# EAGLE board xen_teensy_motherboard_8cv_mki (EAGLE 9.6.0), part 1 of 2
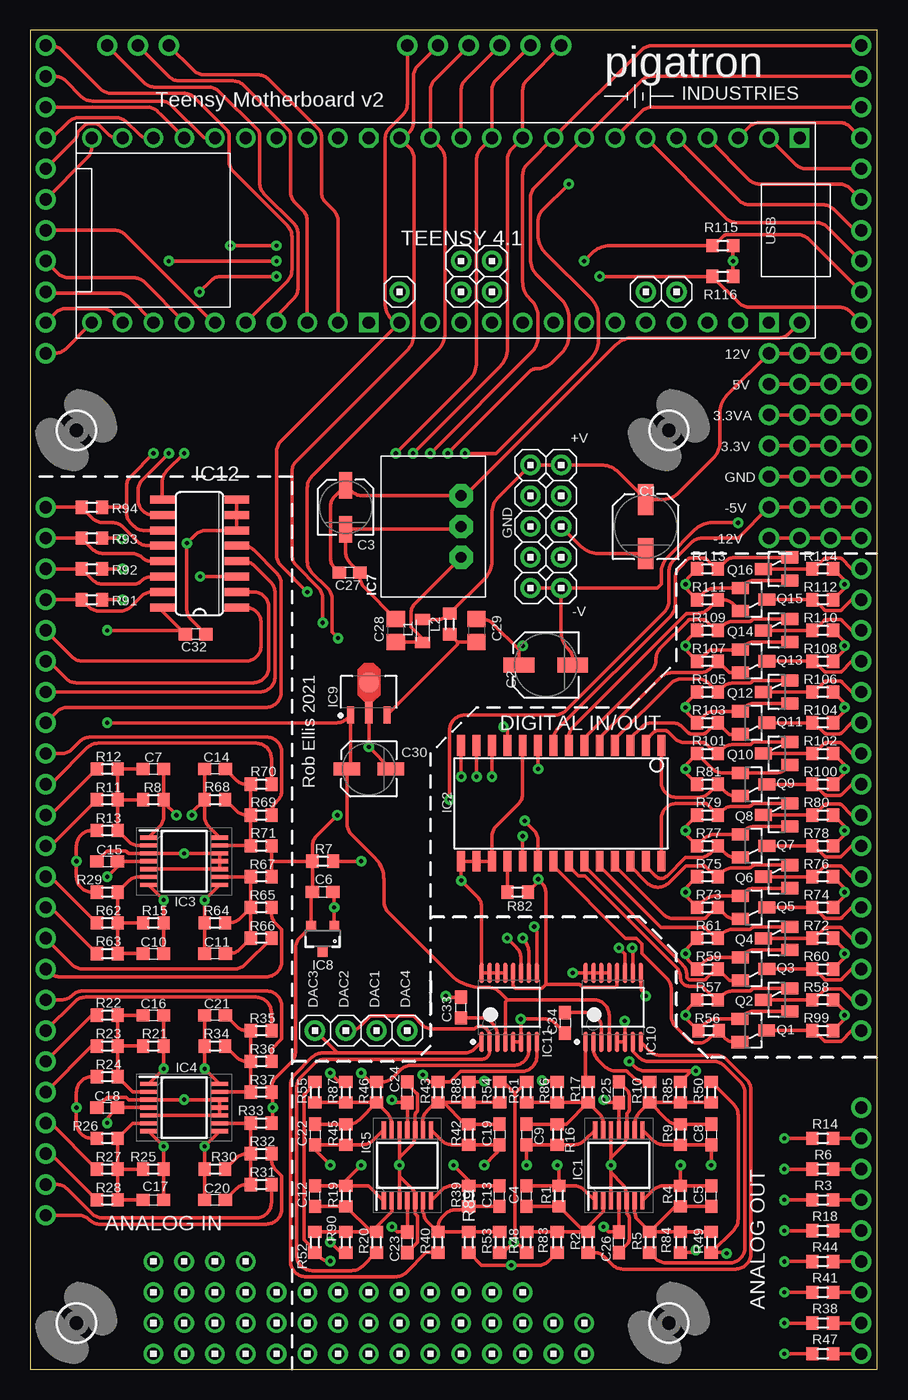
[diagram p1: board, top side]
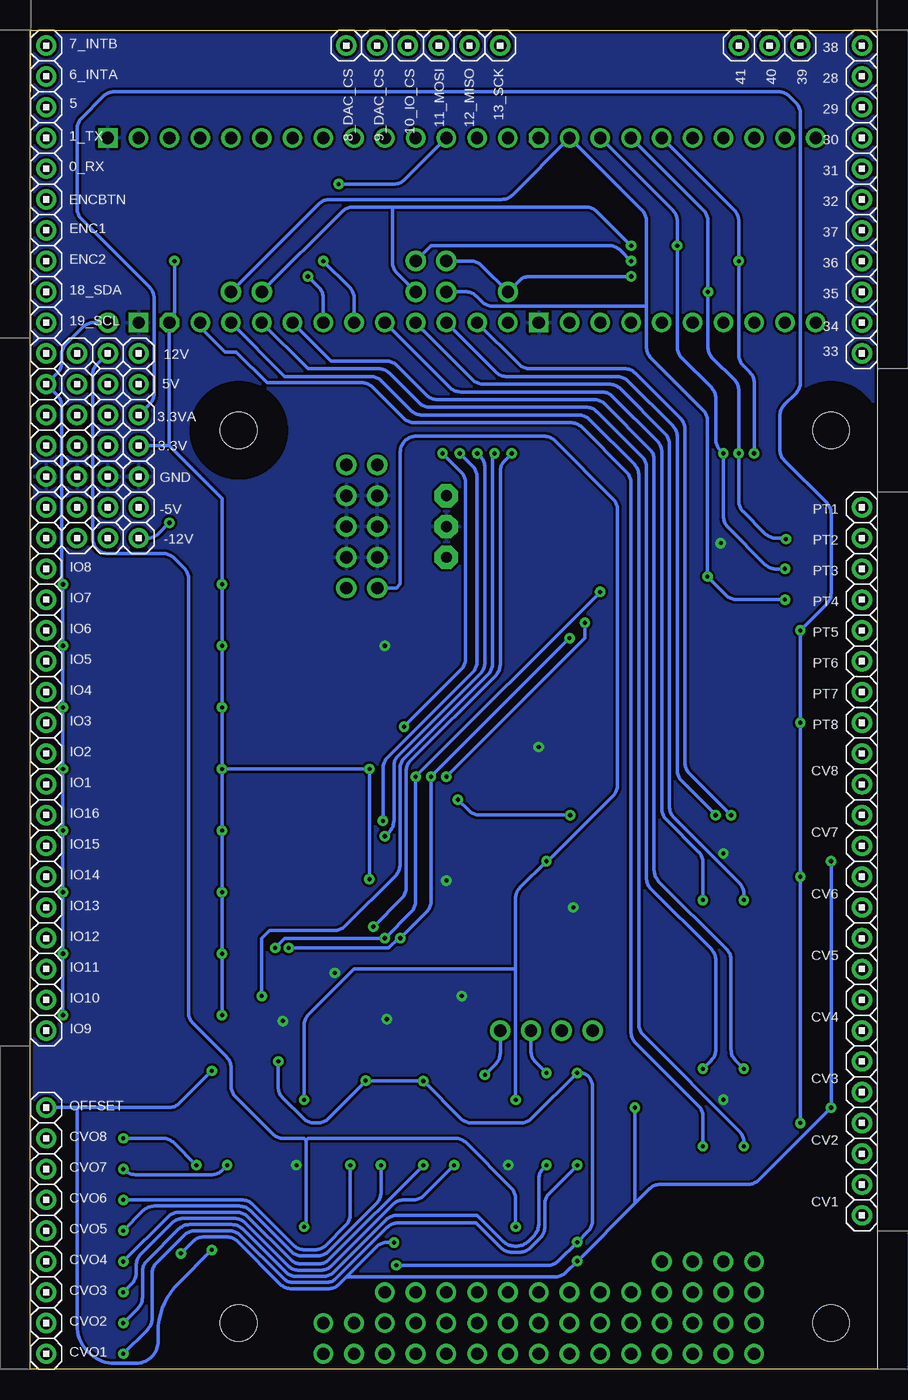
[diagram p2: board, bottom side, seen from below]

Size 69.9 x 110.48 mm. Coordinates in mm from the lower left corner, seen from the top.
Outline: 0,0 69.9,0 69.9,110.48 0,110.48 0,0
Copper layers (1*16): Top 0.0356mm / dielectric 1.5011mm / Bottom 0.0356mm
Design rules "pigatron *": minimum track width 8mil, minimum drill 13mil, track to track 8mil, track to pad 8mil, pad to pad 8mil, via to via 8mil, smd to smd 6mil, copper to edge 10mil, drill to drill 10mil, minimum pad ring 12mil, minimum via ring 10mil, stop-mask expansion 4mil, vias tented up to drill 15mil, thermal gap 10mil

## Footprints (pad centres in the part's own frame; a part is rotated, then mirrored left to right if it is on the bottom)
HEADER/MALE/01 = drill 1.016 pad 1.676: 1 0,0
SV-C = smd 2.54 x 1.27: + -2.223,0; - 2.223,0
SV-B = smd 2.184 x 1.067: + -1.81,0; - 1.81,0
C0603 = smd 1.1 x 1: 1 -0.85,0; 2 0.85,0
C0805 = smd 1.3 x 1.5: 1 -0.95,0; 2 0.95,0
TSSOP14 = smd 0.35 x 1.4: 1 -1.95,-2.938; 2 -1.3,-2.938; 3 -0.65,-2.938; 4 0,-2.938; 5 0.65,-2.938; 6 1.3,-2.938; 7 1.95,-2.938; 8 1.95,2.938; 9 1.3,2.938; 10 0.65,2.938; 11 0,2.938; 12 -0.65,2.938; 13 -1.3,2.938; 14 -1.95,2.938
SO28W = smd 0.65 x 1.7: 1 -7.62,-4.78; 2 -6.35,-4.78; 3 -5.08,-4.78; 4 -3.81,-4.78; 5 -2.54,-4.78; 6 -1.27,-4.78; 7 0,-4.78; 8 1.27,-4.78; 9 2.54,-4.78; 10 3.81,-4.78; 11 5.08,-4.78; 12 6.35,-4.78; 13 7.62,-4.78; 14 8.89,-4.78; 15 8.89,4.78; 16 7.62,4.78; 17 6.35,4.78; 18 5.08,4.78; 19 3.81,4.78; 20 2.54,4.78; 21 1.27,4.78; 22 0,4.78; 23 -1.27,4.78; 24 -2.54,4.78; 25 -3.81,4.78; 26 -5.08,4.78; 27 -6.35,4.78; 28 -7.62,4.78
TENNSY41-OUTER = drill 1: 0-RX1/CS1/CRX2 -27.94,-7.62; 1-TX1/MISO1/CTX2 -25.4,-7.62; 2-OUT2 -22.86,-7.62; 3-LRCLK2 -20.32,-7.62; 4-BCLK2 -17.78,-7.62; 5-IN2 -15.24,-7.62; 6-OUT1D -12.7,-7.62; 7-RX2/OUT1A -10.16,-7.62; 8-TX2/IN1 -7.62,-7.62; 9-OUT1C -5.08,-7.62; 10-CS\MQSR -2.54,-7.62; 11-MOSI/CTX1 0,-7.62; 12-MISO/MQSL 2.54,-7.62; 13-SCK/LED 2.54,7.62; 14-A0/TX3/SPDIF_OUT 0,7.62; 15-A1/RX3/SPDIF_IN -2.54,7.62; 16-A2/RX4/SCL1 -5.08,7.62; 17-A3/TX4/SDA1 -7.62,7.62; 18-A4/SDA0 -10.16,7.62; 19-A5/SCL0 -12.7,7.62; 20-A6/TX5/LRCLK1 -15.24,7.62; 21-A7/RX5/BCLK1 -17.78,7.62; 22-A8/CTX1 -20.32,7.62; 23-A9/CRX1/MCLK1 -22.86,7.62; 24-A10/TX6/SCL2 7.62,-7.62; 25-A11/RX6/SDA2 10.16,-7.62; 26-A12/MOSI1 12.7,-7.62; 27-A13/SCK1 15.24,-7.62; 28-RX7 17.78,-7.62; 29-TX7 20.32,-7.62; 30-CRX3 22.86,-7.62; 31-CTX3 25.4,-7.62; 32-OUT1B 27.94,-7.62; 33-MCLK2 27.94,7.62; 34-RX8 25.4,7.62; 35-TX8 22.86,7.62; 36-PWM 20.32,7.62; 37-PWM 17.78,7.62; 38-A14/CS/IN1 15.24,7.62; 39-A15/CS/OUT1A 12.7,7.62; 40-A16/CS1 10.16,7.62; 41-A17/MISO1 7.62,7.62 | drill 1 octagon: 3V3-1 5.08,-7.62; 3V3-3 -25.4,7.62 | drill 1 square: GND1 -30.48,-7.62; GND3 5.08,7.62; GND6 -27.94,7.62 | drill 1 pad 1.676: VIN -30.48,7.62
WE78 = drill 0.9 pad 1.93 octagon: 1 -2.54,0; 2 0,0; 3 2.54,0
SOT-23 = smd 0.8 x 0.9: 1 -0.95,-1; 2 0.95,-1; 3 0,1.1
LD2981-SOT89 = smd 1.4 x 0.6: 1 -1.9,1.5; 3 -1.9,-1.5 | smd 1.8 x 0.6: 2 -1.7,0 | smd 1.71 x 1.71: 2-2 0.8,0
TEXAS_INSTRUMENTS_DAC8164IBPWG4_1 = smd 1.7 x 0.35: 1 -2.85,2.275; 2 -2.85,1.625; 3 -2.85,0.975; 4 -2.85,0.325; 5 -2.85,-0.325; 6 -2.85,-0.975; 7 -2.85,-1.625; 8 -2.85,-2.275; 9 2.85,-2.275; 10 2.85,-1.625; 11 2.85,-0.975; 12 2.85,-0.325; 13 2.85,0.325; 14 2.85,0.975; 15 2.85,1.625; 16 2.85,2.275
SO16 = smd 0.66 x 2.032: 1 -4.445,-3.073; 2 -3.175,-3.073; 3 -1.905,-3.073; 4 -0.635,-3.073; 5 0.635,-3.073; 6 1.905,-3.073; 7 3.175,-3.073; 8 4.445,-3.073; 9 4.445,3.073; 10 3.175,3.073; 11 1.905,3.073; 12 0.635,3.073; 13 -0.635,3.073; 14 -1.905,3.073; 15 -3.175,3.073; 16 -4.445,3.073
L2012C = smd 0.9 x 1.25: 1 -0.9,0; 2 1,0
R0603 = smd 1 x 1.1: 1 -0.85,0; 2 0.85,0
HEADER/MALE/01/NOBORDER = drill 1.016: 1 0,0
SOT23 = smd 1 x 1.4: 1 -0.95,-1.1; 2 0.95,-1.1; 3 0,1.1
STANDOFF/3.0 = hole 3: 0,0

## Placement (x,y rotation side)
0_RX  HEADER/MALE/01  [HEADER/MALE/01]  68.58,99.06 0 bottom
1_TX  HEADER/MALE/01  [HEADER/MALE/01]  68.58,101.6 0 bottom
3.3V  HEADER/MALE/01  [HEADER/MALE/01]  60.96,76.2 90 bottom
3.3V1  HEADER/MALE/01  [HEADER/MALE/01]  63.5,76.2 180 bottom
3.3V2  HEADER/MALE/01  [HEADER/MALE/01]  66.04,76.2 0 bottom
3.3V3  HEADER/MALE/01  [HEADER/MALE/01]  68.58,76.2 0 bottom
3.3VA  HEADER/MALE/01  [HEADER/MALE/01]  60.96,78.74 180 bottom
3.3VA1  HEADER/MALE/01  [HEADER/MALE/01]  63.5,78.74 0 bottom
3.3VA2  HEADER/MALE/01  [HEADER/MALE/01]  66.04,78.74 0 bottom
3.3VA3  HEADER/MALE/01  [HEADER/MALE/01]  68.58,78.74 0 bottom
5  HEADER/MALE/01  [HEADER/MALE/01]  68.58,104.14 0 bottom
5V  HEADER/MALE/01  [HEADER/MALE/01]  60.96,81.28 180 bottom
5V1  HEADER/MALE/01  [HEADER/MALE/01]  63.5,81.28 180 bottom
5V2  HEADER/MALE/01  [HEADER/MALE/01]  66.04,81.28 0 bottom
5V3  HEADER/MALE/01  [HEADER/MALE/01]  68.58,81.28 0 bottom
6_INTA  HEADER/MALE/01  [HEADER/MALE/01]  68.58,106.68 0 bottom
7_INTB  HEADER/MALE/01  [HEADER/MALE/01]  68.58,109.22 0 bottom
8_DAC_CS  HEADER/MALE/01  [HEADER/MALE/01]  43.81,109.22 270 bottom
9_DAC_CS  HEADER/MALE/01  [HEADER/MALE/01]  41.27,109.22 270 bottom
10_IO_CS  HEADER/MALE/01  [HEADER/MALE/01]  38.73,109.22 270 bottom
11_MOSI  HEADER/MALE/01  [HEADER/MALE/01]  36.2,109.22 270 bottom
12_MISO  HEADER/MALE/01  [HEADER/MALE/01]  33.66,109.22 270 bottom
13_SCK  HEADER/MALE/01  [HEADER/MALE/01]  31.11,109.22 270 bottom
18_SDA  HEADER/MALE/01  [HEADER/MALE/01]  68.58,88.9 0 bottom
19_SCL  HEADER/MALE/01  [HEADER/MALE/01]  68.58,86.36 0 bottom
24_4.0-A10  HEADER/MALE/01  [HEADER/MALE/01]  35.56,88.9 0 top
24_LC-A10  HEADER/MALE/01  [HEADER/MALE/01]  53.34,88.9 90 top
25_4.0-A11  HEADER/MALE/01  [HEADER/MALE/01]  38.1,88.9 0 top
25_LC-A11  HEADER/MALE/01  [HEADER/MALE/01]  50.8,88.9 90 top
26_4.0-A12  HEADER/MALE/01  [HEADER/MALE/01]  35.56,91.44 0 top
26_LC-A12  HEADER/MALE/01  [HEADER/MALE/01]  30.48,88.9 90 top
27_4.0-A13  HEADER/MALE/01  [HEADER/MALE/01]  38.1,91.44 0 top
28  HEADER/MALE/01  [HEADER/MALE/01]  1.27,106.68 180 bottom
29  HEADER/MALE/01  [HEADER/MALE/01]  1.27,104.14 180 bottom
30  HEADER/MALE/01  [HEADER/MALE/01]  1.27,101.6 180 bottom
31  HEADER/MALE/01  [HEADER/MALE/01]  1.27,99.06 180 bottom
32  HEADER/MALE/01  [HEADER/MALE/01]  1.27,96.52 180 bottom
33  HEADER/MALE/01  [HEADER/MALE/01]  1.27,83.82 180 bottom
34  HEADER/MALE/01  [HEADER/MALE/01]  1.27,86.36 180 bottom
35  HEADER/MALE/01  [HEADER/MALE/01]  1.27,88.9 180 bottom
36  HEADER/MALE/01  [HEADER/MALE/01]  1.27,91.44 180 bottom
37  HEADER/MALE/01  [HEADER/MALE/01]  1.27,93.98 180 bottom
38  HEADER/MALE/01  [HEADER/MALE/01]  1.27,109.22 180 bottom
39  HEADER/MALE/01  [HEADER/MALE/01]  6.35,109.22 270 bottom
40  HEADER/MALE/01  [HEADER/MALE/01]  8.89,109.22 270 bottom
41  HEADER/MALE/01  [HEADER/MALE/01]  11.43,109.22 270 bottom
+V  HEADER/MALE/01  [HEADER/MALE/01]  43.81,74.61 0 top
+V1  HEADER/MALE/01  [HEADER/MALE/01]  63.5,83.82 0 bottom
+V2  HEADER/MALE/01  [HEADER/MALE/01]  41.27,74.61 180 top
+V3  HEADER/MALE/01  [HEADER/MALE/01]  60.96,83.82 0 bottom
+V4  HEADER/MALE/01  [HEADER/MALE/01]  66.04,83.82 0 bottom
+V5  HEADER/MALE/01  [HEADER/MALE/01]  68.58,83.82 0 bottom
-5V  HEADER/MALE/01  [HEADER/MALE/01]  63.5,71.12 180 bottom
-5V1  HEADER/MALE/01  [HEADER/MALE/01]  60.96,71.12 180 bottom
-5V2  HEADER/MALE/01  [HEADER/MALE/01]  66.04,71.12 0 bottom
-5V3  HEADER/MALE/01  [HEADER/MALE/01]  68.58,71.12 0 bottom
-V  HEADER/MALE/01  [HEADER/MALE/01]  43.81,64.45 0 top
-V1  HEADER/MALE/01  [HEADER/MALE/01]  60.96,68.58 0 bottom
-V2  HEADER/MALE/01  [HEADER/MALE/01]  41.27,64.45 180 top
-V3  HEADER/MALE/01  [HEADER/MALE/01]  63.5,68.58 0 bottom
-V4  HEADER/MALE/01  [HEADER/MALE/01]  66.04,68.58 0 bottom
-V5  HEADER/MALE/01  [HEADER/MALE/01]  68.58,68.58 0 bottom
C1  22uF  [SV-C]  50.8,69.53 270 top
C2  22uF  [SV-C]  42.55,58.1 0 top
C3  10uF  [SV-B]  26.04,71.12 270 top
C4  100pF  [C0603]  40.96,14.29 90 top
C5  100pF  [C0603]  56.2,14.29 90 top
C6  100nF  [C0603]  24.13,39.37 180 top
C7  1nF  [C0603]  10.16,49.53 0 top
C8  100pF  [C0603]  56.2,19.37 270 top
C9  100pF  [C0603]  40.96,19.37 270 top
C10  1nF  [C0603]  10.16,34.29 0 top
C11  1nF  [C0603]  15.24,34.29 180 top
C12  100pF  [C0603]  23.5,14.29 90 top
C13  100pF  [C0603]  38.73,14.29 90 top
C14  1nF  [C0603]  15.24,49.53 180 top
C15  100nF  [C0603]  6.35,41.91 0 top
C16  1nF  [C0603]  10.16,29.21 0 top
C17  1nF  [C0603]  10.16,13.97 0 top
C18  100nF  [C0603]  6.35,21.59 0 top
C19  100pF  [C0603]  38.73,19.37 270 top
C20  1nF  [C0603]  15.24,13.97 180 top
C21  1nF  [C0603]  15.24,29.21 180 top
C22  100pF  [C0603]  23.5,19.37 270 top
C23  100nF  [C0603]  31.11,10.48 90 top
C24  100nF  [C0603]  31.11,22.86 90 top
C25  100nF  [C0603]  48.58,22.86 90 top
C26  100nF  [C0603]  48.58,10.48 90 top
C27  100nF  [C0603]  26.35,65.72 180 top
C28  22uF  [C0805]  30.16,60.96 270 top
C29  22uF  [C0805]  36.83,60.96 270 top
C30  10uF  [SV-B]  27.94,49.53 0 top
C32  100nF  [C0603]  13.65,60.64 180 top
C33  470nF  [C0603]  35.56,29.84 90 top
C34  470nF  [C0603]  44.13,28.57 270 top
CV1  HEADER/MALE/01  [HEADER/MALE/01]  1.27,15.24 0 bottom
CV1B  HEADER/MALE/01  [HEADER/MALE/01]  1.27,12.7 0 bottom
CV2  HEADER/MALE/01  [HEADER/MALE/01]  1.27,20.32 0 bottom
CV2B  HEADER/MALE/01  [HEADER/MALE/01]  1.27,17.78 0 bottom
CV3  HEADER/MALE/01  [HEADER/MALE/01]  1.27,25.4 0 bottom
CV3B  HEADER/MALE/01  [HEADER/MALE/01]  1.27,22.86 0 bottom
CV4  HEADER/MALE/01  [HEADER/MALE/01]  1.27,27.94 0 bottom
CV4B  HEADER/MALE/01  [HEADER/MALE/01]  1.27,30.48 0 bottom
CV5  HEADER/MALE/01  [HEADER/MALE/01]  1.27,33.02 180 bottom
CV5B  HEADER/MALE/01  [HEADER/MALE/01]  1.27,35.56 180 bottom
CV6  HEADER/MALE/01  [HEADER/MALE/01]  1.27,40.64 180 bottom
CV6B  HEADER/MALE/01  [HEADER/MALE/01]  1.27,38.1 180 bottom
CV7  HEADER/MALE/01  [HEADER/MALE/01]  1.27,43.18 180 bottom
CV7B  HEADER/MALE/01  [HEADER/MALE/01]  1.27,45.72 180 bottom
CV8  HEADER/MALE/01  [HEADER/MALE/01]  1.27,50.8 180 bottom
CV8B  HEADER/MALE/01  [HEADER/MALE/01]  1.27,48.26 180 bottom
CVO1  HEADER/MALE/01  [HEADER/MALE/01]  68.58,1.27 0 bottom
CVO2  HEADER/MALE/01  [HEADER/MALE/01]  68.58,3.81 0 bottom
CVO3  HEADER/MALE/01  [HEADER/MALE/01]  68.58,6.35 0 bottom
CVO4  HEADER/MALE/01  [HEADER/MALE/01]  68.58,8.89 0 bottom
CVO5  HEADER/MALE/01  [HEADER/MALE/01]  68.58,11.43 0 bottom
CVO6  HEADER/MALE/01  [HEADER/MALE/01]  68.58,13.97 0 bottom
CVO7  HEADER/MALE/01  [HEADER/MALE/01]  68.58,16.51 0 bottom
CVO8  HEADER/MALE/01  [HEADER/MALE/01]  68.58,19.05 0 bottom
DAC1  HEADER/MALE/01  [HEADER/MALE/01]  28.57,27.94 90 top
DAC2  HEADER/MALE/01  [HEADER/MALE/01]  26.04,27.94 90 top
DAC3  HEADER/MALE/01  [HEADER/MALE/01]  23.5,27.94 90 top
DAC4  HEADER/MALE/01  [HEADER/MALE/01]  31.11,27.94 90 top
ENC1  HEADER/MALE/01  [HEADER/MALE/01]  68.58,93.98 0 bottom
ENC2  HEADER/MALE/01  [HEADER/MALE/01]  68.58,91.44 0 bottom
ENCBTN  HEADER/MALE/01  [HEADER/MALE/01]  68.58,96.52 0 bottom
GND  HEADER/MALE/01  [HEADER/MALE/01]  43.81,69.53 0 top
GND1  HEADER/MALE/01  [HEADER/MALE/01]  43.81,72.07 0 top
GND2  HEADER/MALE/01  [HEADER/MALE/01]  41.27,66.99 180 top
GND3  HEADER/MALE/01  [HEADER/MALE/01]  43.81,66.99 180 top
GND4  HEADER/MALE/01  [HEADER/MALE/01]  41.27,69.53 0 top
GND5  HEADER/MALE/01  [HEADER/MALE/01]  41.27,72.07 0 top
GND6  HEADER/MALE/01  [HEADER/MALE/01]  63.5,73.66 0 bottom
GND7  HEADER/MALE/01  [HEADER/MALE/01]  60.96,73.66 0 bottom
GND8  HEADER/MALE/01  [HEADER/MALE/01]  66.04,73.66 0 bottom
GND9  HEADER/MALE/01  [HEADER/MALE/01]  68.58,73.66 0 bottom
IC1  TL074PW  [TSSOP14]  48.58,16.83 0 top
IC2  MCP23S17SO  [SO28W]  44.45,46.69 180 top
IC3  MCP6004  [TSSOP14]  12.7,41.91 270 top
IC4  MCP6004  [TSSOP14]  12.7,21.59 270 top
IC5  TL074PW  [TSSOP14]  31.11,16.83 0 top
IC6  TEENSY41-OUTER  [TENNSY41-OUTER]  33.02,93.98 180 top
IC7  R-78E5.0-0.5  [WE78]  35.56,69.53 90 top
IC8  LM4040-5V  [SOT-23]  24.13,35.56 180 top
IC9  3.3V  [LD2981-SOT89]  27.94,55.88 90 top
IC10  DAC8164  [TEXAS_INSTRUMENTS_DAC8164IBPWG4_1]  48.1,29.84 90 top
IC11  DAC8164  [TEXAS_INSTRUMENTS_DAC8164IBPWG4_1]  39.53,29.84 90 top
IC12  CD4051CD4051_SO16  [SO16]  13.97,67.31 90 top
IO1  HEADER/MALE/01  [HEADER/MALE/01]  68.58,48.26 180 bottom
IO2  HEADER/MALE/01  [HEADER/MALE/01]  68.58,50.8 180 bottom
IO3  HEADER/MALE/01  [HEADER/MALE/01]  68.58,53.34 180 bottom
IO4  HEADER/MALE/01  [HEADER/MALE/01]  68.58,55.88 180 bottom
IO5  HEADER/MALE/01  [HEADER/MALE/01]  68.58,58.42 180 bottom
IO6  HEADER/MALE/01  [HEADER/MALE/01]  68.58,60.96 180 bottom
IO7  HEADER/MALE/01  [HEADER/MALE/01]  68.58,63.5 180 bottom
IO8  HEADER/MALE/01  [HEADER/MALE/01]  68.58,66.04 180 bottom
IO9  HEADER/MALE/01  [HEADER/MALE/01]  68.58,27.94 180 bottom
IO10  HEADER/MALE/01  [HEADER/MALE/01]  68.58,30.48 180 bottom
IO11  HEADER/MALE/01  [HEADER/MALE/01]  68.58,33.02 180 bottom
IO12  HEADER/MALE/01  [HEADER/MALE/01]  68.58,35.56 180 bottom
IO13  HEADER/MALE/01  [HEADER/MALE/01]  68.58,38.1 180 bottom
IO14  HEADER/MALE/01  [HEADER/MALE/01]  68.58,40.64 180 bottom
IO15  HEADER/MALE/01  [HEADER/MALE/01]  68.58,43.18 180 bottom
IO16  HEADER/MALE/01  [HEADER/MALE/01]  68.58,45.72 180 bottom
L1  33uH  [L2012C]  32.38,60.96 270 top
L2  [R0603]  34.61,61.49 270 top
OFFSET  HEADER/MALE/01  [HEADER/MALE/01]  68.58,21.59 180 bottom
P1  HEADER/MALE/01NOBORDER  [HEADER/MALE/01/NOBORDER]  10.16,1.27 0 top
P2  HEADER/MALE/01NOBORDER  [HEADER/MALE/01/NOBORDER]  12.7,1.27 0 top
P3  HEADER/MALE/01NOBORDER  [HEADER/MALE/01/NOBORDER]  15.24,1.27 0 top
P4  HEADER/MALE/01NOBORDER  [HEADER/MALE/01/NOBORDER]  17.78,1.27 0 top
P5  HEADER/MALE/01NOBORDER  [HEADER/MALE/01/NOBORDER]  20.32,1.27 0 top
P6  HEADER/MALE/01NOBORDER  [HEADER/MALE/01/NOBORDER]  10.16,3.81 0 top
P7  HEADER/MALE/01NOBORDER  [HEADER/MALE/01/NOBORDER]  12.7,3.81 0 top
P8  HEADER/MALE/01NOBORDER  [HEADER/MALE/01/NOBORDER]  15.24,3.81 0 top
P9  HEADER/MALE/01NOBORDER  [HEADER/MALE/01/NOBORDER]  17.78,3.81 0 top
P10  HEADER/MALE/01NOBORDER  [HEADER/MALE/01/NOBORDER]  20.32,3.81 0 top
P11  HEADER/MALE/01NOBORDER  [HEADER/MALE/01/NOBORDER]  10.16,6.35 0 top
P12  HEADER/MALE/01NOBORDER  [HEADER/MALE/01/NOBORDER]  12.7,6.35 0 top
P13  HEADER/MALE/01NOBORDER  [HEADER/MALE/01/NOBORDER]  15.24,6.35 0 top
P14  HEADER/MALE/01NOBORDER  [HEADER/MALE/01/NOBORDER]  17.78,6.35 0 top
P15  HEADER/MALE/01NOBORDER  [HEADER/MALE/01/NOBORDER]  20.32,6.35 0 top
P16  HEADER/MALE/01NOBORDER  [HEADER/MALE/01/NOBORDER]  10.16,8.89 0 top
P17  HEADER/MALE/01NOBORDER  [HEADER/MALE/01/NOBORDER]  12.7,8.89 0 top
P18  HEADER/MALE/01NOBORDER  [HEADER/MALE/01/NOBORDER]  15.24,8.89 0 top
P19  HEADER/MALE/01NOBORDER  [HEADER/MALE/01/NOBORDER]  17.78,8.89 0 top
P21  HEADER/MALE/01NOBORDER  [HEADER/MALE/01/NOBORDER]  22.86,1.27 0 top
P22  HEADER/MALE/01NOBORDER  [HEADER/MALE/01/NOBORDER]  22.86,3.81 0 top
P23  HEADER/MALE/01NOBORDER  [HEADER/MALE/01/NOBORDER]  25.4,1.27 0 top
P24  HEADER/MALE/01NOBORDER  [HEADER/MALE/01/NOBORDER]  22.86,6.35 0 top
P25  HEADER/MALE/01NOBORDER  [HEADER/MALE/01/NOBORDER]  25.4,3.81 0 top
P26  HEADER/MALE/01NOBORDER  [HEADER/MALE/01/NOBORDER]  25.4,6.35 0 top
P27  HEADER/MALE/01NOBORDER  [HEADER/MALE/01/NOBORDER]  30.48,6.35 0 top
P28  HEADER/MALE/01NOBORDER  [HEADER/MALE/01/NOBORDER]  27.94,6.35 0 top
P29  HEADER/MALE/01NOBORDER  [HEADER/MALE/01/NOBORDER]  30.48,3.81 0 top
P30  HEADER/MALE/01NOBORDER  [HEADER/MALE/01/NOBORDER]  27.94,3.81 0 top
P31  HEADER/MALE/01NOBORDER  [HEADER/MALE/01/NOBORDER]  30.48,1.27 0 top
P32  HEADER/MALE/01NOBORDER  [HEADER/MALE/01/NOBORDER]  27.94,1.27 0 top
P33  HEADER/MALE/01NOBORDER  [HEADER/MALE/01/NOBORDER]  33.02,6.35 0 top
P34  HEADER/MALE/01NOBORDER  [HEADER/MALE/01/NOBORDER]  33.02,3.81 0 top
P35  HEADER/MALE/01NOBORDER  [HEADER/MALE/01/NOBORDER]  35.56,6.35 0 top
P36  HEADER/MALE/01NOBORDER  [HEADER/MALE/01/NOBORDER]  33.02,1.27 0 top
P37  HEADER/MALE/01NOBORDER  [HEADER/MALE/01/NOBORDER]  38.1,3.81 0 top
P38  HEADER/MALE/01NOBORDER  [HEADER/MALE/01/NOBORDER]  35.56,3.81 0 top
P39  HEADER/MALE/01NOBORDER  [HEADER/MALE/01/NOBORDER]  40.64,6.35 0 top
P40  HEADER/MALE/01NOBORDER  [HEADER/MALE/01/NOBORDER]  35.56,1.27 0 top
P41  HEADER/MALE/01NOBORDER  [HEADER/MALE/01/NOBORDER]  40.64,3.81 0 top
P42  HEADER/MALE/01NOBORDER  [HEADER/MALE/01/NOBORDER]  38.1,6.35 0 top
P44  HEADER/MALE/01NOBORDER  [HEADER/MALE/01/NOBORDER]  38.1,1.27 0 top
P45  HEADER/MALE/01NOBORDER  [HEADER/MALE/01/NOBORDER]  43.18,3.81 0 top
P46  HEADER/MALE/01NOBORDER  [HEADER/MALE/01/NOBORDER]  40.64,1.27 0 top
P47  HEADER/MALE/01NOBORDER  [HEADER/MALE/01/NOBORDER]  43.18,1.27 0 top
P49  HEADER/MALE/01NOBORDER  [HEADER/MALE/01/NOBORDER]  45.72,3.81 0 top
P50  HEADER/MALE/01NOBORDER  [HEADER/MALE/01/NOBORDER]  45.72,1.27 0 top
PT1  HEADER/MALE/01  [HEADER/MALE/01]  1.27,71.12 180 bottom
PT2  HEADER/MALE/01  [HEADER/MALE/01]  1.27,68.58 180 bottom
PT3  HEADER/MALE/01  [HEADER/MALE/01]  1.27,66.04 180 bottom
PT4  HEADER/MALE/01  [HEADER/MALE/01]  1.27,63.5 180 bottom
PT5  HEADER/MALE/01  [HEADER/MALE/01]  1.27,60.96 180 bottom
PT6  HEADER/MALE/01  [HEADER/MALE/01]  1.27,58.42 180 bottom
PT7  HEADER/MALE/01  [HEADER/MALE/01]  1.27,55.88 180 bottom
PT8  HEADER/MALE/01  [HEADER/MALE/01]  1.27,53.34 180 bottom
Q1  BF170  [SOT23]  59.67,27.94 270 top
Q2  BF170  [SOT23]  61.59,30.48 90 top
Q3  BF170  [SOT23]  59.69,33.02 270 top
Q4  BF170  [SOT23]  61.59,35.56 90 top
Q5  BF170  [SOT23]  59.69,38.1 270 top
Q6  BF170  [SOT23]  61.59,40.64 90 top
Q7  BF170  [SOT23]  59.69,43.18 270 top
Q8  BF170  [SOT23]  61.59,45.72 90 top
Q9  BF170  [SOT23]  59.69,48.26 270 top
Q10  BF170  [SOT23]  61.59,50.8 90 top
Q11  BF170  [SOT23]  59.69,53.34 270 top
Q12  BF170  [SOT23]  61.59,55.88 90 top
Q13  BF170  [SOT23]  59.69,58.42 270 top
Q14  BF170  [SOT23]  61.59,60.96 90 top
Q15  BF170  [SOT23]  59.69,63.5 270 top
Q16  BF170  [SOT23]  61.59,66.04 90 top
R1  120k  [R0603]  43.62,14.29 90 top
R2  30k  [R0603]  46.04,10.48 90 top
R3  1k  [R0603]  65.41,13.97 0 top
R4  120k  [R0603]  53.66,14.29 90 top
R5  30k  [R0603]  51.12,10.48 90 top
R6  1k  [R0603]  65.41,16.51 0 top
R7  2K  [R0603]  24.13,41.91 0 top
R8  33k  [R0603]  10.16,46.99 0 top
R9  120k  [R0603]  53.66,19.37 270 top
R10  30k  [R0603]  51.12,22.86 270 top
R11  100k  [R0603]  6.35,46.99 0 top
R12  100k  [R0603]  6.35,49.53 0 top
R13  100k  [R0603]  6.35,44.45 0 top
R14  1k  [R0603]  65.41,19.05 0 top
R15  33k  [R0603]  10.16,36.83 0 top
R16  120k  [R0603]  43.5,19.37 270 top
R17  30k  [R0603]  46.04,22.86 270 top
R18  1k  [R0603]  65.41,11.43 0 top
R19  120k  [R0603]  26.04,14.29 90 top
R20  30k  [R0603]  28.57,10.48 90 top
R21  33k  [R0603]  10.16,26.67 0 top
R22  100k  [R0603]  6.35,29.21 0 top
R23  100k  [R0603]  6.35,26.67 0 top
R24  100k  [R0603]  6.35,24.13 0 top
R25  33k  [R0603]  10.16,16.51 0 top
R26  100k  [R0603]  6.35,19.05 0 top
R27  100k  [R0603]  6.35,16.51 0 top
R28  100k  [R0603]  6.35,13.97 0 top
R29  100k  [R0603]  6.35,39.37 0 top
R30  33k  [R0603]  15.24,16.51 180 top
R31  100k  [R0603]  19.05,15.24 180 top
R32  100k  [R0603]  19.05,17.78 180 top
R33  100k  [R0603]  19.05,20.32 180 top
R34  33k  [R0603]  15.24,26.67 180 top
R35  100k  [R0603]  19.05,27.94 180 top
R36  100k  [R0603]  19.05,25.4 180 top
R37  100k  [R0603]  19.05,22.86 180 top
R38  1k  [R0603]  65.41,3.81 0 top
R39  120k  [R0603]  36.2,14.29 90 top
R40  30k  [R0603]  33.66,10.48 90 top
R41  1k  [R0603]  65.41,6.35 0 top
R42  120k  [R0603]  36.2,19.37 270 top
R43  30k  [R0603]  33.66,22.86 270 top
R44  1k  [R0603]  65.41,8.89 0 top
R45  120k  [R0603]  26.04,19.37 270 top
R46  30k  [R0603]  28.57,22.86 270 top
R47  1k  [R0603]  65.41,1.27 0 top
R48  120k  [R0603]  40.96,10.48 90 top
R49  120k  [R0603]  56.2,10.48 90 top
R50  120k  [R0603]  56.2,22.86 270 top
R51  120k  [R0603]  40.96,22.86 270 top
R52  120k  [R0603]  23.5,10.48 90 top
R53  120k  [R0603]  38.73,10.48 90 top
R54  120k  [R0603]  38.73,22.86 270 top
R55  120k  [R0603]  23.5,22.86 270 top
R56  10k  [R0603]  55.98,27.94 180 top
R57  10k  [R0603]  55.88,30.48 180 top
R58  10k  [R0603]  65.41,30.48 0 top
R59  10k  [R0603]  55.88,33.02 180 top
R60  10k  [R0603]  65.41,33.02 0 top
R61  10k  [R0603]  55.88,35.56 180 top
R62  100k  [R0603]  6.35,36.83 0 top
R63  100k  [R0603]  6.35,34.29 0 top
R64  33k  [R0603]  15.24,36.83 180 top
R65  100k  [R0603]  19.05,38.1 180 top
R66  100k  [R0603]  19.05,35.56 180 top
R67  100k  [R0603]  19.05,40.64 180 top
R68  33k  [R0603]  15.24,46.99 180 top
R69  100k  [R0603]  19.05,45.72 180 top
R70  100k  [R0603]  19.05,48.26 180 top
R71  100k  [R0603]  19.05,43.18 180 top
R72  10k  [R0603]  65.41,35.56 0 top
R73  10k  [R0603]  55.88,38.1 180 top
R74  10k  [R0603]  65.41,38.1 0 top
R75  10k  [R0603]  55.88,40.64 180 top
R76  10k  [R0603]  65.41,40.64 0 top
R77  10k  [R0603]  55.88,43.18 180 top
R78  10k  [R0603]  65.41,43.18 0 top
R79  10k  [R0603]  55.88,45.72 180 top
R80  10k  [R0603]  65.41,45.72 0 top
R81  10k  [R0603]  55.88,48.26 180 top
R82  1k  [R0603]  40.22,39.37 180 top
R83  120k  [R0603]  43.5,10.48 90 top
R84  120k  [R0603]  53.66,10.48 90 top
R85  120k  [R0603]  53.66,22.86 270 top
R86  120k  [R0603]  43.5,22.86 270 top
R87  120k  [R0603]  26.04,22.86 270 top
R88  120k  [R0603]  36.2,22.86 270 top
R89  120k  [R0603]  36.2,10.48 90 top
R90  120k  [R0603]  26.04,10.48 90 top
R91  0R  [R0603]  5.08,63.5 0 top
R92  0R  [R0603]  5.08,66.04 0 top
R93  0R  [R0603]  5.08,68.58 0 top
R94  0R  [R0603]  5.08,71.12 0 top
R99  10k  [R0603]  65.41,27.94 0 top
R100  10k  [R0603]  65.41,48.26 0 top
R101  10k  [R0603]  55.88,50.8 180 top
R102  10k  [R0603]  65.41,50.8 0 top
R103  10k  [R0603]  55.88,53.34 180 top
R104  10k  [R0603]  65.41,53.34 0 top
R105  10k  [R0603]  55.88,55.88 180 top
R106  10k  [R0603]  65.41,55.88 0 top
R107  10k  [R0603]  55.88,58.42 180 top
R108  10k  [R0603]  65.41,58.42 0 top
R109  10k  [R0603]  55.88,60.96 180 top
R110  10k  [R0603]  65.41,60.96 0 top
R111  10k  [R0603]  55.88,63.5 180 top
R112  10k  [R0603]  65.41,63.5 0 top
R113  10k  [R0603]  55.88,66.04 180 top
R114  10k  [R0603]  65.41,66.04 0 top
R115  2K  [R0603]  57.15,92.71 0 top
R116  2K  [R0603]  57.15,90.17 0 top
U$1  [PIGATRON-LOGO]  56.26,106.62 0 top
U$2  [STANDOFF/3.0]  52.7,3.81 180 top
U$3  [STANDOFF/3.0]  3.81,3.81 180 top
U$4  [STANDOFF/3.0]  52.7,77.47 180 top
U$5  [STANDOFF/3.0]  3.81,77.47 180 top